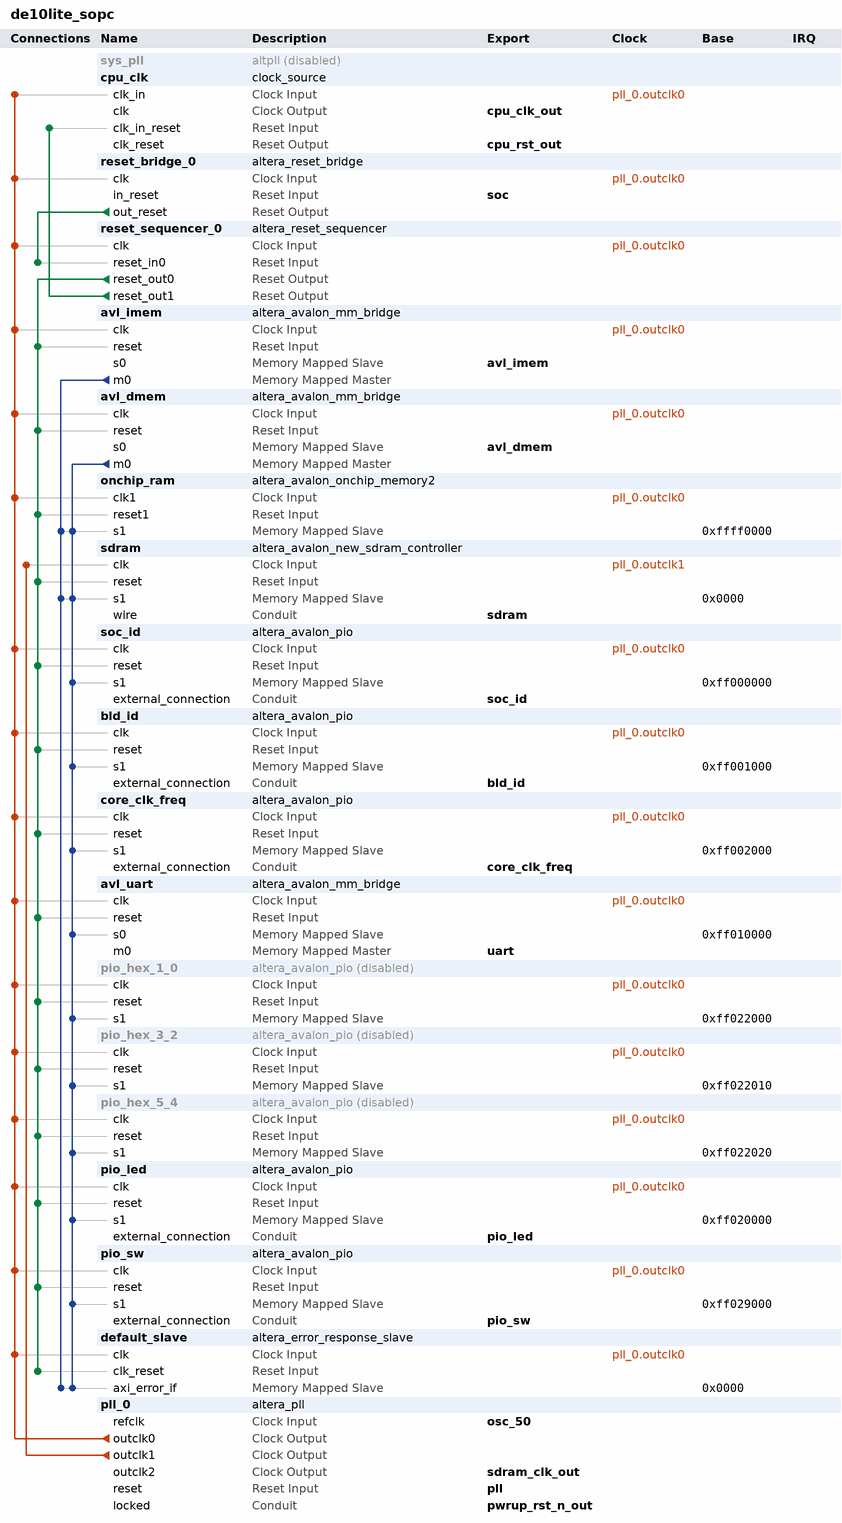
[diagram p0: system contents]
# Platform Designer (Qsys) system de10lite_sopc, Cyclone V 5CSEMA5F31C6
# Parameters at their usual value, and those the tool derives, are not listed.
package require -exact qsys 17.1
create_system de10lite_sopc
set_project_property DEVICE_FAMILY {Cyclone V}
set_project_property DEVICE 5CSEMA5F31C6

add_instance sys_pll altpll 17.1
set_instance_property sys_pll ENABLED false
set_instance_parameter_value sys_pll CLK0_DIVIDE_BY 5
set_instance_parameter_value sys_pll CLK0_MULTIPLY_BY 2
set_instance_parameter_value sys_pll CLK1_DIVIDE_BY 1
set_instance_parameter_value sys_pll CLK1_DUTY_CYCLE 50
set_instance_parameter_value sys_pll CLK1_MULTIPLY_BY 2
set_instance_parameter_value sys_pll CLK1_PHASE_SHIFT 0
set_instance_parameter_value sys_pll CLK2_DIVIDE_BY 1
set_instance_parameter_value sys_pll CLK2_DUTY_CYCLE 50
set_instance_parameter_value sys_pll CLK2_MULTIPLY_BY 2
set_instance_parameter_value sys_pll CLK2_PHASE_SHIFT 3000
set_instance_parameter_value sys_pll INCLK0_INPUT_FREQUENCY 20000
set_instance_parameter_value sys_pll PORT_ARESET PORT_UNUSED
set_instance_parameter_value sys_pll PORT_LOCKED PORT_USED
set_instance_parameter_value sys_pll PORT_clk1 PORT_USED
set_instance_parameter_value sys_pll PORT_clk2 PORT_USED
set_instance_parameter_value sys_pll PORT_clk3 PORT_UNUSED

add_instance cpu_clk clock_source 17.1
set_instance_parameter_value cpu_clk clockFrequency 20000000
set_instance_parameter_value cpu_clk resetSynchronousEdges DEASSERT

add_instance reset_bridge_0 altera_reset_bridge 17.1
set_instance_parameter_value reset_bridge_0 ACTIVE_LOW_RESET 1
set_instance_parameter_value reset_bridge_0 SYNCHRONOUS_EDGES deassert

add_instance reset_sequencer_0 altera_reset_sequencer 17.1
set_instance_parameter_value reset_sequencer_0 ENABLE_CSR 0
set_instance_parameter_value reset_sequencer_0 ENABLE_RESET_REQUEST_INPUT 0
set_instance_parameter_value reset_sequencer_0 LIST_ASRT_DELAY 0,0,0,0,0,0,0,0,0,0
set_instance_parameter_value reset_sequencer_0 LIST_ASRT_SEQ 0,1,2,3,4,5,6,7,8,9
set_instance_parameter_value reset_sequencer_0 LIST_DSRT_DELAY 0,128,0,0,0,0,0,0,0,0
set_instance_parameter_value reset_sequencer_0 LIST_DSRT_SEQ 0,1,2,3,4,5,6,7,8,9
set_instance_parameter_value reset_sequencer_0 MIN_ASRT_TIME 0
set_instance_parameter_value reset_sequencer_0 NUM_INPUTS 1
set_instance_parameter_value reset_sequencer_0 NUM_OUTPUTS 2
set_instance_parameter_value reset_sequencer_0 USE_DSRT_QUAL 0,0,0,0,0,0,0,0,0,0

add_instance avl_imem altera_avalon_mm_bridge 17.1
set_instance_parameter_value avl_imem ADDRESS_UNITS SYMBOLS
set_instance_parameter_value avl_imem ADDRESS_WIDTH 32
set_instance_parameter_value avl_imem DATA_WIDTH 32
set_instance_parameter_value avl_imem MAX_PENDING_RESPONSES 1
set_instance_parameter_value avl_imem USE_AUTO_ADDRESS_WIDTH 0
set_instance_parameter_value avl_imem USE_RESPONSE 1

add_instance avl_dmem altera_avalon_mm_bridge 17.1
set_instance_parameter_value avl_dmem ADDRESS_UNITS SYMBOLS
set_instance_parameter_value avl_dmem ADDRESS_WIDTH 32
set_instance_parameter_value avl_dmem DATA_WIDTH 32
set_instance_parameter_value avl_dmem MAX_PENDING_RESPONSES 1
set_instance_parameter_value avl_dmem USE_AUTO_ADDRESS_WIDTH 0
set_instance_parameter_value avl_dmem USE_RESPONSE 1

add_instance onchip_ram altera_avalon_onchip_memory2 17.1
set_instance_parameter_value onchip_ram dataWidth 64
set_instance_parameter_value onchip_ram dualPort false
set_instance_parameter_value onchip_ram initMemContent true
set_instance_parameter_value onchip_ram initializationFileName scbl.hex
set_instance_parameter_value onchip_ram memorySize 65536
set_instance_parameter_value onchip_ram resetrequest_enabled false
set_instance_parameter_value onchip_ram useNonDefaultInitFile true

add_instance sdram altera_avalon_new_sdram_controller 17.1
set_instance_parameter_value sdram TAC 5.4
set_instance_parameter_value sdram TRCD 15.0
set_instance_parameter_value sdram TRP 15.0
set_instance_parameter_value sdram casLatency 3
set_instance_parameter_value sdram columnWidth 10
set_instance_parameter_value sdram dataWidth 16
set_instance_parameter_value sdram generateSimulationModel false
set_instance_parameter_value sdram model single_Micron_MT48LC4M32B2_7_chip
set_instance_parameter_value sdram numberOfBanks 4
set_instance_parameter_value sdram numberOfChipSelects 1
set_instance_parameter_value sdram powerUpDelay 100.0
set_instance_parameter_value sdram refreshPeriod 7.8125
set_instance_parameter_value sdram rowWidth 13

add_instance soc_id altera_avalon_pio 17.1
set_instance_parameter_value soc_id direction Input
set_instance_parameter_value soc_id width 32

add_instance bld_id altera_avalon_pio 17.1
set_instance_parameter_value bld_id direction Input
set_instance_parameter_value bld_id simDoTestBenchWiring true
set_instance_parameter_value bld_id simDrivenValue 3738876602
set_instance_parameter_value bld_id width 32

add_instance core_clk_freq altera_avalon_pio 17.1
set_instance_parameter_value core_clk_freq direction Input
set_instance_parameter_value core_clk_freq width 32

add_instance avl_uart altera_avalon_mm_bridge 17.1
set_instance_parameter_value avl_uart ADDRESS_UNITS SYMBOLS
set_instance_parameter_value avl_uart ADDRESS_WIDTH 5
set_instance_parameter_value avl_uart DATA_WIDTH 32
set_instance_parameter_value avl_uart MAX_PENDING_RESPONSES 1
set_instance_parameter_value avl_uart PIPELINE_COMMAND 0
set_instance_parameter_value avl_uart PIPELINE_RESPONSE 0
set_instance_parameter_value avl_uart USE_AUTO_ADDRESS_WIDTH 0

add_instance pio_hex_1_0 altera_avalon_pio 17.1
set_instance_property pio_hex_1_0 ENABLED false
set_instance_parameter_value pio_hex_1_0 direction Output
set_instance_parameter_value pio_hex_1_0 resetValue 65535
set_instance_parameter_value pio_hex_1_0 width 16

add_instance pio_hex_3_2 altera_avalon_pio 17.1
set_instance_property pio_hex_3_2 ENABLED false
set_instance_parameter_value pio_hex_3_2 direction Output
set_instance_parameter_value pio_hex_3_2 resetValue 65535
set_instance_parameter_value pio_hex_3_2 width 16

add_instance pio_hex_5_4 altera_avalon_pio 17.1
set_instance_property pio_hex_5_4 ENABLED false
set_instance_parameter_value pio_hex_5_4 direction Output
set_instance_parameter_value pio_hex_5_4 resetValue 65535
set_instance_parameter_value pio_hex_5_4 width 16

add_instance pio_led altera_avalon_pio 17.1
set_instance_parameter_value pio_led direction Output
set_instance_parameter_value pio_led width 19

add_instance pio_sw altera_avalon_pio 17.1
set_instance_parameter_value pio_sw direction Input
set_instance_parameter_value pio_sw simDoTestBenchWiring true
set_instance_parameter_value pio_sw width 19

add_instance default_slave altera_error_response_slave 17.1
set_instance_parameter_value default_slave AXI_ADDR_W 32
set_instance_parameter_value default_slave AXI_DATA_W 32
set_instance_parameter_value default_slave AXI_ID_W 4
set_instance_parameter_value default_slave LOG_CSR_DEPTH 1
set_instance_parameter_value default_slave REGISTER_AV_INPUTS 0
set_instance_parameter_value default_slave SUPPORT_CSR 0

add_instance pll_0 altera_pll 17.1
set_instance_parameter_value pll_0 gui_device_speed_grade 1
set_instance_parameter_value pll_0 gui_number_of_clocks 3
set_instance_parameter_value pll_0 gui_operation_mode direct
set_instance_parameter_value pll_0 gui_output_clock_frequency0 20.0
set_instance_parameter_value pll_0 gui_output_clock_frequency1 100.0
set_instance_parameter_value pll_0 gui_output_clock_frequency2 100.0
set_instance_parameter_value pll_0 gui_pll_mode {Integer-N PLL}
set_instance_parameter_value pll_0 gui_reference_clock_frequency 100.0
set_instance_parameter_value pll_0 gui_use_locked true

# connections
add_connection pll_0.outclk0 avl_dmem.clk clock
add_connection pll_0.outclk0 avl_imem.clk clock
add_connection pll_0.outclk0 avl_uart.clk clock
add_connection pll_0.outclk0 bld_id.clk clock
add_connection pll_0.outclk0 core_clk_freq.clk clock
add_connection pll_0.outclk0 cpu_clk.clk_in clock
add_connection pll_0.outclk0 default_slave.clk clock
add_connection pll_0.outclk0 onchip_ram.clk1 clock
add_connection pll_0.outclk0 pio_hex_1_0.clk clock
add_connection pll_0.outclk0 pio_hex_3_2.clk clock
add_connection pll_0.outclk0 pio_hex_5_4.clk clock
add_connection pll_0.outclk0 pio_led.clk clock
add_connection pll_0.outclk0 pio_sw.clk clock
add_connection pll_0.outclk0 reset_bridge_0.clk clock
add_connection pll_0.outclk0 reset_sequencer_0.clk clock
add_connection pll_0.outclk0 soc_id.clk clock
add_connection pll_0.outclk1 sdram.clk clock
add_connection reset_bridge_0.out_reset reset_sequencer_0.reset_in0 reset
add_connection reset_sequencer_0.reset_out0 avl_dmem.reset reset
add_connection reset_sequencer_0.reset_out0 avl_imem.reset reset
add_connection reset_sequencer_0.reset_out0 avl_uart.reset reset
add_connection reset_sequencer_0.reset_out0 bld_id.reset reset
add_connection reset_sequencer_0.reset_out0 core_clk_freq.reset reset
add_connection reset_sequencer_0.reset_out0 default_slave.clk_reset reset
add_connection reset_sequencer_0.reset_out0 onchip_ram.reset1 reset
add_connection reset_sequencer_0.reset_out0 pio_hex_1_0.reset reset
add_connection reset_sequencer_0.reset_out0 pio_hex_3_2.reset reset
add_connection reset_sequencer_0.reset_out0 pio_hex_5_4.reset reset
add_connection reset_sequencer_0.reset_out0 pio_led.reset reset
add_connection reset_sequencer_0.reset_out0 pio_sw.reset reset
add_connection reset_sequencer_0.reset_out0 sdram.reset reset
add_connection reset_sequencer_0.reset_out0 soc_id.reset reset
add_connection reset_sequencer_0.reset_out1 cpu_clk.clk_in_reset reset
add_connection avl_dmem.m0 avl_uart.s0 avalon
set_connection_parameter_value avl_dmem.m0/avl_uart.s0 baseAddress 0xff010000
add_connection avl_dmem.m0 bld_id.s1 avalon
set_connection_parameter_value avl_dmem.m0/bld_id.s1 baseAddress 0xff001000
add_connection avl_dmem.m0 core_clk_freq.s1 avalon
set_connection_parameter_value avl_dmem.m0/core_clk_freq.s1 baseAddress 0xff002000
add_connection avl_dmem.m0 default_slave.axi_error_if avalon
set_connection_parameter_value avl_dmem.m0/default_slave.axi_error_if baseAddress 0x0000
set_connection_parameter_value avl_dmem.m0/default_slave.axi_error_if defaultConnection true
add_connection avl_dmem.m0 onchip_ram.s1 avalon
set_connection_parameter_value avl_dmem.m0/onchip_ram.s1 baseAddress 0xffff0000
add_connection avl_dmem.m0 pio_hex_1_0.s1 avalon
set_connection_parameter_value avl_dmem.m0/pio_hex_1_0.s1 baseAddress 0xff022000
add_connection avl_dmem.m0 pio_hex_3_2.s1 avalon
set_connection_parameter_value avl_dmem.m0/pio_hex_3_2.s1 baseAddress 0xff022010
add_connection avl_dmem.m0 pio_hex_5_4.s1 avalon
set_connection_parameter_value avl_dmem.m0/pio_hex_5_4.s1 baseAddress 0xff022020
add_connection avl_dmem.m0 pio_led.s1 avalon
set_connection_parameter_value avl_dmem.m0/pio_led.s1 baseAddress 0xff020000
add_connection avl_dmem.m0 pio_sw.s1 avalon
set_connection_parameter_value avl_dmem.m0/pio_sw.s1 baseAddress 0xff029000
add_connection avl_dmem.m0 sdram.s1 avalon
set_connection_parameter_value avl_dmem.m0/sdram.s1 baseAddress 0x0000
add_connection avl_dmem.m0 soc_id.s1 avalon
set_connection_parameter_value avl_dmem.m0/soc_id.s1 baseAddress 0xff000000
add_connection avl_imem.m0 default_slave.axi_error_if avalon
set_connection_parameter_value avl_imem.m0/default_slave.axi_error_if baseAddress 0x0000
set_connection_parameter_value avl_imem.m0/default_slave.axi_error_if defaultConnection true
add_connection avl_imem.m0 onchip_ram.s1 avalon
set_connection_parameter_value avl_imem.m0/onchip_ram.s1 baseAddress 0xffff0000
add_connection avl_imem.m0 sdram.s1 avalon
set_connection_parameter_value avl_imem.m0/sdram.s1 baseAddress 0x0000

# exported interfaces
add_interface avl_dmem avalon slave
set_interface_property avl_dmem EXPORT_OF avl_dmem.s0
add_interface avl_imem avalon slave
set_interface_property avl_imem EXPORT_OF avl_imem.s0
add_interface bld_id conduit end
set_interface_property bld_id EXPORT_OF bld_id.external_connection
add_interface core_clk_freq conduit end
set_interface_property core_clk_freq EXPORT_OF core_clk_freq.external_connection
add_interface cpu_clk_out clock source
set_interface_property cpu_clk_out EXPORT_OF cpu_clk.clk
add_interface cpu_rst_out reset source
set_interface_property cpu_rst_out EXPORT_OF cpu_clk.clk_reset
add_interface osc_50 clock sink
set_interface_property osc_50 EXPORT_OF pll_0.refclk
add_interface pio_led conduit end
set_interface_property pio_led EXPORT_OF pio_led.external_connection
add_interface pio_sw conduit end
set_interface_property pio_sw EXPORT_OF pio_sw.external_connection
add_interface pll reset sink
set_interface_property pll EXPORT_OF pll_0.reset
add_interface pwrup_rst_n_out conduit end
set_interface_property pwrup_rst_n_out EXPORT_OF pll_0.locked
add_interface sdram conduit end
set_interface_property sdram EXPORT_OF sdram.wire
add_interface sdram_clk_out clock source
set_interface_property sdram_clk_out EXPORT_OF pll_0.outclk2
add_interface soc reset sink
set_interface_property soc EXPORT_OF reset_bridge_0.in_reset
add_interface soc_id conduit end
set_interface_property soc_id EXPORT_OF soc_id.external_connection
add_interface uart avalon master
set_interface_property uart EXPORT_OF avl_uart.m0

set_interconnect_requirement {$system} qsys_mm.clockCrossingAdapter AUTO
set_interconnect_requirement {$system} qsys_mm.maxAdditionalLatency 0

save_system de10lite_sopc.qsys
